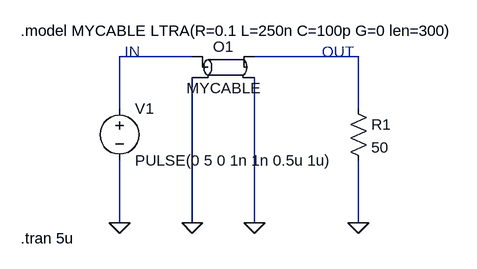
[diagram p0: schematic Q1) Signal Transmission through Wired Media.asc]
Q1) Signal Transmission through Wired Media.asc, the LTspice schematic file:
Version 4
SHEET 1 880 680
WIRE 208 0 96 0
WIRE 464 0 304 0
WIRE 96 80 96 0
WIRE 464 80 464 0
WIRE 96 256 96 160
WIRE 208 256 208 32
WIRE 304 256 304 32
WIRE 464 256 464 160
FLAG 96 256 0
FLAG 208 256 0
FLAG 464 256 0
FLAG 304 256 0
SYMBOL voltage 96 64 R0
WINDOW 123 0 0 Left 0
WINDOW 39 0 0 Left 0
SYMATTR InstName V1
SYMATTR Value PULSE(0 5 0 1n 1n 0.5u 1u)
SYMBOL ltline 256 16 R0
SYMATTR InstName O1
SYMATTR Value MYCABLE
SYMBOL res 448 64 R0
SYMATTR InstName R1
SYMATTR Value 50
TEXT -56 -40 Left 2 !.model MYCABLE LTRA(R=0.1 L=250n C=100p G=0 len=300)
TEXT 104 -8 Left 2 ;IN
TEXT 408 -8 Left 2 ;OUT
TEXT -56 280 Left 2 !.tran 5u

The netlist it stands for:
* Q1) Signal Transmission through Wired Media.asc
V1 N001 0 PULSE(0 5 0 1n 1n 0.5u 1u)
O1 N001 0 N002 0 MYCABLE
R1 N002 0 50
.model MYCABLE LTRA(R=0.1 L=250n C=100p G=0 len=300)
* IN
* OUT
.tran 5u
.backanno
.end